# Altium schematic sheet power.SchDoc
size A4
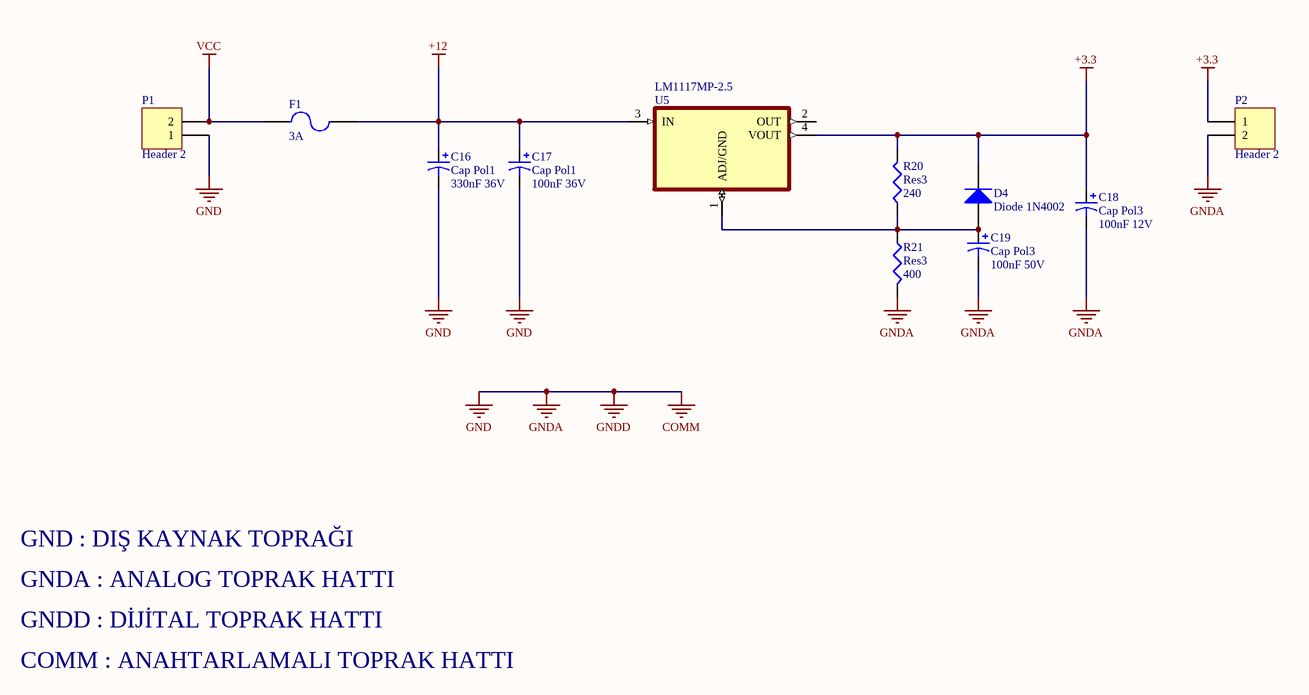
[diagram p0: power.SchDoc]

## Parts
C16  Cap Pol1  value 330nF 36V  [RB7.6-15]
C17  Cap Pol1  value 100nF 36V  [RB7.6-15]
C18  Cap Pol3  value 100nF 12V  [C0805]
C19  Cap Pol3  value 100nF 50V  [C0805]
D4  Diode 1N4002  [DO-41]
F1  3A  [PIN-W2/E2.8]
P1  Header 2  [HDR1X2]
P2  Header 2  [HDR1X2]
R20  Res3  value 240  [J1-0603]
R21  Res3  value 400  [J1-0603]
U5  LM1117MP-2.5  [LM1117 SMD]

## Nets
+3.3: C18.1 D4.2(K) P2.1 R20.2 U5.4(VOUT)
+12: C16.1 C17.1 F1.2 U5.3(IN)
COMM: C16.2 C17.2 C18.2 C19.2 P1.1 P2.2 R21.2  [also labelled GND, GNDA, GNDD]
VCC: F1.1 P1.2
NetC19_1: C19.1 D4.1(A) R20.1 R21.1 U5.1(ADJ/GND)

Not connected (* = marked no-connect by the designer): U5 2(OUT)

## Notes on the sheet
- GND : DIŞ KAYNAK TOPRAĞI
- GNDA : ANALOG TOPRAK HATTI
- GNDD : DİJİTAL TOPRAK HATTI
- COMM : ANAHTARLAMALI TOPRAK HATTI

## Library data of the parts
C16 C17 = Cap Pol1: Polarized Capacitor (Radial); Published: 8-Jun-2000; LatestRevisionDate: 17-Jul-2002; LatestRevisionNote: Re-released for DXP Platform.; PackageReference: RB7.6-15; Publisher: Altium Limited; PackageDescription: Polarized Capacitor (Radial); 2 Leads
C18 C19 = Cap Pol3: Polarized Capacitor (Surface Mount); Published: 8-Jun-2000; LatestRevisionDate: 29-May-2009; LatestRevisionNote: IPC-7351 Footprint Added.; PackageReference: C0805; Publisher: Altium Limited; PackageDescription: Chip Capacitor
D4 = Diode 1N4007: 1 Amp General Purpose Rectifier; Published: 8-Jun-2000; LatestRevisionDate: 17-Jul-2002; LatestRevisionNote: Re-released for DXP Platform.; DatasheetVersion: 1998; PackageVersion: Aug-1999; PackageReference: DO-41; Publisher: Altium Limited; PackageDescription: Diode, Axial; Body 5.2 x 2.7 mm (LxDia. max), Lead Dia. 0.86 mm (max); Code_JEDEC: DO-204-AL; ComponentLink1Description: Manufacturer Link; ComponentLink1URL: http://www.fairchildsemi.com/; ComponentLink2Description: Datasheet; ComponentLink2URL: http://www.fairchildsemi.com/ds/1N%2F1N4001.pdf
F1 = Fuse 2: Fuse; Published: 8-Jun-2000; LatestRevisionDate: 17-Jul-2002; LatestRevisionNote: Re-released for DXP Platform.; PackageReference: PIN-W2/E2.8; Publisher: Altium Limited; PackageDescription: Thru-Hole; 2 Leads
P1 P2 = Header 2: Header, 2-Pin; LatestRevisionDate: 17-Jul-2002; LatestRevisionNote: Re-released for DXP Platform.; Publisher: Altium Limited
R20 R21 = Res3: Resistor; Published: 8-Jun-2000; LatestRevisionDate: 29-May-2009; LatestRevisionNote: IPC-7351 Footprint Added.; PackageReference: J1-0603; Publisher: Altium Limited; PackageDescription: Chip Resistor
U5 = LM1117MP-2.5: 800-mA 15-V linear voltage regulator 4-SOT-223 0 to 125; MP: LM1117MP-2.5/NOPB; MF: Texas Instruments; Purchase-URL: https://pricing.snapeda.com/search/part/LM1117MP-2.5/NOPB/?ref=eda; SnapEDA_Link: https://www.snapeda.com/parts/LM1117MP-2.5/NOPB/Texas%20Instruments/view-part/108187/?ref=snap; Availability: Warning; Package: SOT-223-4 Texas Instruments; Value: *; Price: None; Check_prices: https://www.snapeda.com/parts/LM1117MP-2.5/NOPB/Texas%20Instruments/view-part/108187/?ref=eda